# Altium schematic sheet Audio_Connectors.SchDoc
size A
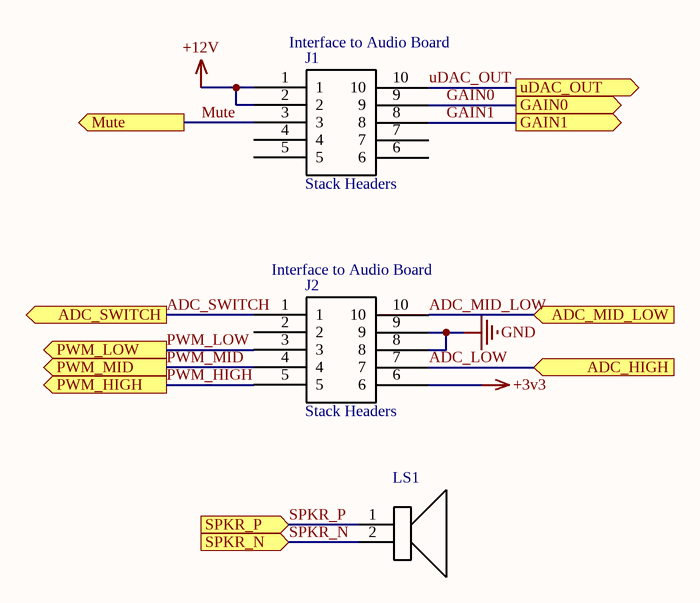
[diagram p0: Audio_Connectors.SchDoc]

## Parts
J1  Stack Headers  [SSW-105]
J2  Stack Headers  [SSW-105]
LS1  Made for use with 20AWG  [Speaker]  (value not drawn)

## Ports
ADC_HIGH (in), ADC_MID_LOW (in), ADC_SWITCH (out), GAIN0 (out), GAIN1 (out), Mute (out), PWM_HIGH (out), PWM_LOW (out), PWM_MID (out), SPKR_N (in), SPKR_P (in), uDAC_OUT (out)

## Nets
+3v3: J2.6
+12V: J1.1 J1.2
GND: J2.8 J2.9
ADC_LOW: J2.7 ; port ADC_HIGH
ADC_MID_LOW: J2.10 ; port ADC_MID_LOW
ADC_SWITCH: J2.1 ; port ADC_SWITCH
GAIN0: J1.9 ; port GAIN0
GAIN1: J1.8 ; port GAIN1
Mute: J1.3 ; port Mute
PWM_HIGH: J2.5 ; port PWM_HIGH
PWM_LOW: J2.3 ; port PWM_LOW
PWM_MID: J2.4 ; port PWM_MID
SPKR_N: LS1.2 ; port SPKR_N
SPKR_P: LS1.1 ; port SPKR_P
uDAC_OUT: J1.10 ; port uDAC_OUT

Not connected (* = marked no-connect by the designer): J1 4 5 6 7; J2 2

## Notes on the sheet
- (near J1) Interface to Audio Board
- (near J2) Interface to Audio Board

## Library data of the parts
J1 J2 = Stack Headers: System: Connector
LS1 = Speaker_Footprint